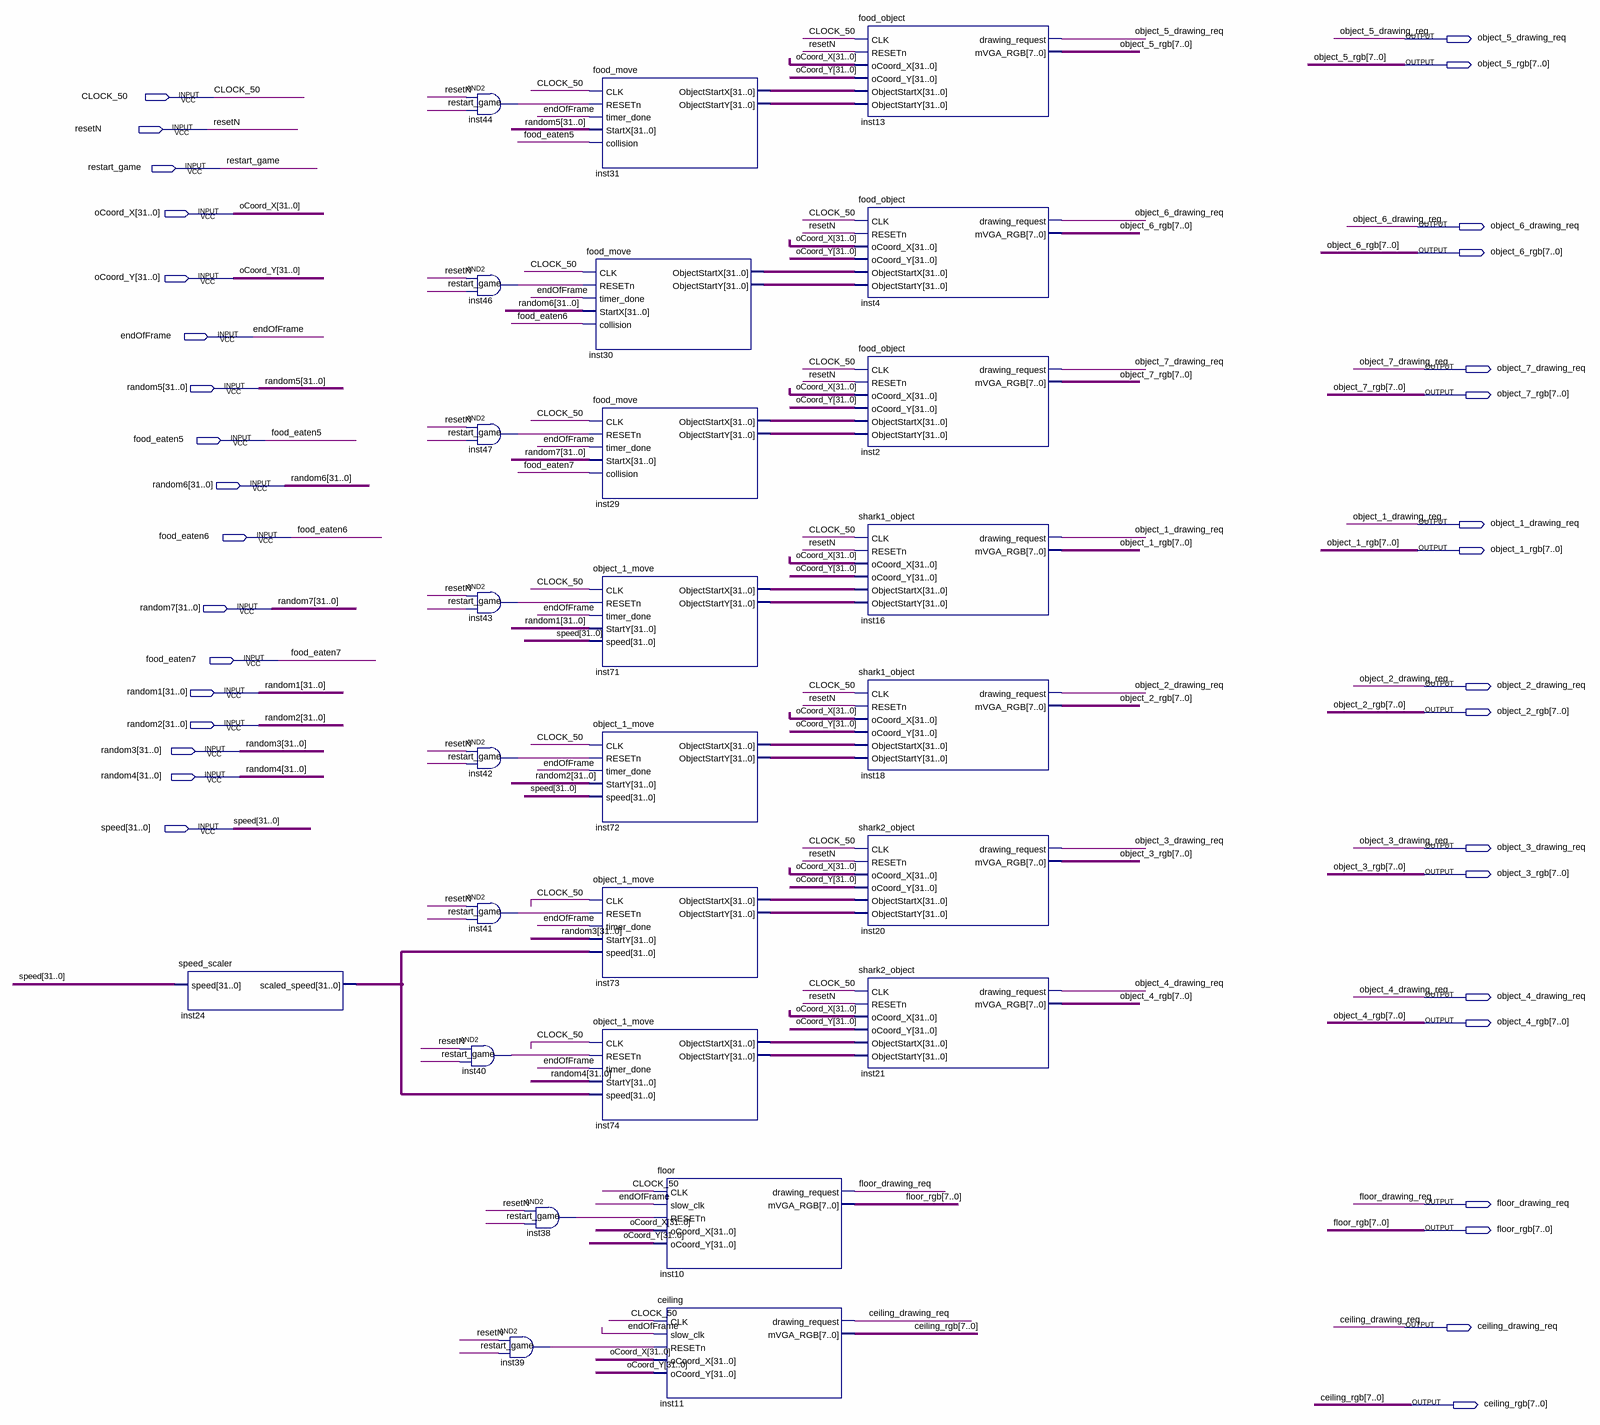
[diagram p0: schematic sheet]
// Quartus schematic objects_top.bdf as structural Verilog: 26 symbols, 35 pins
module objects_top (
  input  CLOCK_50,
  input  resetN,
  input  restart_game,
  input  [31:0] oCoord_X,
  input  [31:0] oCoord_Y,
  input  endOfFrame,
  input  [31:0] random5,
  input  food_eaten5,
  input  [31:0] random6,
  input  food_eaten6,
  input  [31:0] random7,
  input  food_eaten7,
  input  [31:0] random1,
  input  [31:0] random2,
  input  [31:0] random3,
  input  [31:0] random4,
  input  [31:0] speed,
  output object_5_drawing_req,
  output [7:0] object_5_rgb,
  output object_6_drawing_req,
  output [7:0] object_6_rgb,
  output object_7_drawing_req,
  output [7:0] object_7_rgb,
  output object_1_drawing_req,
  output [7:0] object_1_rgb,
  output object_2_drawing_req,
  output [7:0] object_2_rgb,
  output object_3_drawing_req,
  output [7:0] object_3_rgb,
  output object_4_drawing_req,
  output [7:0] object_4_rgb,
  output floor_drawing_req,
  output [7:0] floor_rgb,
  output ceiling_drawing_req,
  output [7:0] ceiling_rgb
);

  wire inst38_out, inst39_out, inst40_out, inst41_out, inst42_out, inst43_out, inst44_out, inst46_out,
       inst47_out;
  wire [31:0] inst24_scaled_speed, inst29_objectstartx, inst29_objectstarty, inst30_objectstartx,
       inst30_objectstarty, inst31_objectstartx, inst31_objectstarty, inst71_objectstartx,
       inst71_objectstarty, inst72_objectstartx, inst72_objectstarty, inst73_objectstartx,
       inst73_objectstarty, inst74_objectstartx, inst74_objectstarty;

  speed_scaler inst24 (.speed(speed), .scaled_speed(inst24_scaled_speed));
  and inst44 (inst44_out, resetN, restart_game);
  and inst46 (inst46_out, resetN, restart_game);
  and inst47 (inst47_out, resetN, restart_game);
  and inst43 (inst43_out, resetN, restart_game);
  and inst42 (inst42_out, resetN, restart_game);
  and inst41 (inst41_out, resetN, restart_game);
  and inst40 (inst40_out, resetN, restart_game);
  and inst39 (inst39_out, resetN, restart_game);
  and inst38 (inst38_out, resetN, restart_game);
  food_move inst31 (
    .CLK(CLOCK_50), .RESETn(inst44_out), .timer_done(endOfFrame), .StartX(random5), .collision(food_eaten5),
    .ObjectStartX(inst31_objectstartx), .ObjectStartY(inst31_objectstarty));
  food_move inst30 (
    .CLK(CLOCK_50), .RESETn(inst46_out), .timer_done(endOfFrame), .StartX(random6), .collision(food_eaten6),
    .ObjectStartX(inst30_objectstartx), .ObjectStartY(inst30_objectstarty));
  food_move inst29 (
    .CLK(CLOCK_50), .RESETn(inst47_out), .timer_done(endOfFrame), .StartX(random7), .collision(food_eaten7),
    .ObjectStartX(inst29_objectstartx), .ObjectStartY(inst29_objectstarty));
  object_1_move inst71 (
    .CLK(CLOCK_50), .RESETn(inst43_out), .timer_done(endOfFrame), .StartY(random1), .speed(speed),
    .ObjectStartX(inst71_objectstartx), .ObjectStartY(inst71_objectstarty));
  object_1_move inst72 (
    .CLK(CLOCK_50), .RESETn(inst42_out), .timer_done(endOfFrame), .StartY(random2), .speed(speed),
    .ObjectStartX(inst72_objectstartx), .ObjectStartY(inst72_objectstarty));
  object_1_move inst73 (
    .CLK(CLOCK_50), .RESETn(inst41_out), .timer_done(endOfFrame), .StartY(random3),
    .speed(inst24_scaled_speed), .ObjectStartX(inst73_objectstartx), .ObjectStartY(inst73_objectstarty));
  object_1_move inst74 (
    .CLK(CLOCK_50), .RESETn(inst40_out), .timer_done(endOfFrame), .StartY(random4),
    .speed(inst24_scaled_speed), .ObjectStartX(inst74_objectstartx), .ObjectStartY(inst74_objectstarty));
  floor inst10 (
    .CLK(CLOCK_50), .slow_clk(endOfFrame), .RESETn(inst38_out), .oCoord_X(oCoord_X), .oCoord_Y(oCoord_Y),
    .drawing_request(floor_drawing_req), .mVGA_RGB(floor_rgb));
  ceiling inst11 (
    .CLK(CLOCK_50), .slow_clk(endOfFrame), .RESETn(inst39_out), .oCoord_X(oCoord_X), .oCoord_Y(oCoord_Y),
    .drawing_request(ceiling_drawing_req), .mVGA_RGB(ceiling_rgb));
  food_object inst13 (
    .CLK(CLOCK_50), .RESETn(resetN), .oCoord_X(oCoord_X), .oCoord_Y(oCoord_Y),
    .ObjectStartX(inst31_objectstartx), .ObjectStartY(inst31_objectstarty),
    .drawing_request(object_5_drawing_req), .mVGA_RGB(object_5_rgb));
  food_object inst4 (
    .CLK(CLOCK_50), .RESETn(resetN), .oCoord_X(oCoord_X), .oCoord_Y(oCoord_Y),
    .ObjectStartX(inst30_objectstartx), .ObjectStartY(inst30_objectstarty),
    .drawing_request(object_6_drawing_req), .mVGA_RGB(object_6_rgb));
  food_object inst2 (
    .CLK(CLOCK_50), .RESETn(resetN), .oCoord_X(oCoord_X), .oCoord_Y(oCoord_Y),
    .ObjectStartX(inst29_objectstartx), .ObjectStartY(inst29_objectstarty),
    .drawing_request(object_7_drawing_req), .mVGA_RGB(object_7_rgb));
  shark1_object inst16 (
    .CLK(CLOCK_50), .RESETn(resetN), .oCoord_X(oCoord_X), .oCoord_Y(oCoord_Y),
    .ObjectStartX(inst71_objectstartx), .ObjectStartY(inst71_objectstarty),
    .drawing_request(object_1_drawing_req), .mVGA_RGB(object_1_rgb));
  shark1_object inst18 (
    .CLK(CLOCK_50), .RESETn(resetN), .oCoord_X(oCoord_X), .oCoord_Y(oCoord_Y),
    .ObjectStartX(inst72_objectstartx), .ObjectStartY(inst72_objectstarty),
    .drawing_request(object_2_drawing_req), .mVGA_RGB(object_2_rgb));
  shark2_object inst20 (
    .CLK(CLOCK_50), .RESETn(resetN), .oCoord_X(oCoord_X), .oCoord_Y(oCoord_Y),
    .ObjectStartX(inst73_objectstartx), .ObjectStartY(inst73_objectstarty),
    .drawing_request(object_3_drawing_req), .mVGA_RGB(object_3_rgb));
  shark2_object inst21 (
    .CLK(CLOCK_50), .RESETn(resetN), .oCoord_X(oCoord_X), .oCoord_Y(oCoord_Y),
    .ObjectStartX(inst74_objectstartx), .ObjectStartY(inst74_objectstarty),
    .drawing_request(object_4_drawing_req), .mVGA_RGB(object_4_rgb));
endmodule
